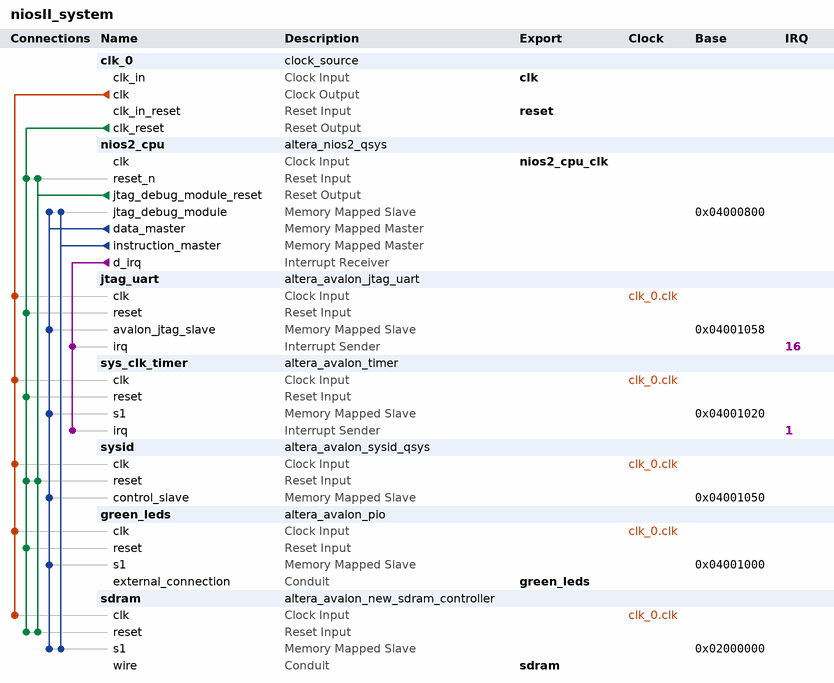
[diagram p0: system contents]
# Platform Designer (Qsys) system niosII_system, Cyclone IV E EP4CE22F17C6
# Parameters at their usual value, and those the tool derives, are not listed.
package require -exact qsys 12.1
create_system niosII_system
set_project_property DEVICE_FAMILY {Cyclone IV E}
set_project_property DEVICE EP4CE22F17C6

add_instance clk_0 clock_source 12.1
set_instance_parameter_value clk_0 clockFrequency 100000000
set_instance_parameter_value clk_0 resetSynchronousEdges DEASSERT

add_instance nios2_cpu altera_nios2_qsys 12.1
set_instance_parameter_value nios2_cpu resetSlave sdram.s1
set_instance_parameter_value nios2_cpu exceptionSlave sdram.s1
set_instance_parameter_value nios2_cpu breakSlave nios2_cpu.jtag_debug_module
set_instance_parameter_value nios2_cpu impl Fast
set_instance_parameter_value nios2_cpu icache_size 8192
set_instance_parameter_value nios2_cpu dcache_size 4096

add_instance jtag_uart altera_avalon_jtag_uart 12.1
set_instance_parameter_value jtag_uart simInteractiveOptions INTERACTIVE_INPUT_OUTPUT

add_instance sys_clk_timer altera_avalon_timer 12.1
set_instance_parameter_value sys_clk_timer period 1
set_instance_parameter_value sys_clk_timer periodUnits MSEC
set_instance_parameter_value sys_clk_timer timerPreset CUSTOM

add_instance sysid altera_avalon_sysid_qsys 12.1
set_instance_parameter_value sysid id 0

add_instance green_leds altera_avalon_pio 12.1
set_instance_parameter_value green_leds bitModifyingOutReg true
set_instance_parameter_value green_leds direction Output
set_instance_parameter_value green_leds width 7

add_instance sdram altera_avalon_new_sdram_controller 12.1
set_instance_parameter_value sdram TAC 5.5
set_instance_parameter_value sdram TRCD 20.0
set_instance_parameter_value sdram TRP 20.0
set_instance_parameter_value sdram casLatency 3
set_instance_parameter_value sdram columnWidth 9
set_instance_parameter_value sdram dataWidth 16
set_instance_parameter_value sdram generateSimulationModel false
set_instance_parameter_value sdram initRefreshCommands 8
set_instance_parameter_value sdram model custom
set_instance_parameter_value sdram numberOfBanks 4
set_instance_parameter_value sdram numberOfChipSelects 1
set_instance_parameter_value sdram powerUpDelay 200.0
set_instance_parameter_value sdram refreshPeriod 7.8125
set_instance_parameter_value sdram rowWidth 13

# connections
add_connection clk_0.clk green_leds.clk clock
add_connection clk_0.clk jtag_uart.clk clock
add_connection clk_0.clk sdram.clk clock
add_connection clk_0.clk sys_clk_timer.clk clock
add_connection clk_0.clk sysid.clk clock
add_connection clk_0.clk_reset green_leds.reset reset
add_connection clk_0.clk_reset jtag_uart.reset reset
add_connection clk_0.clk_reset nios2_cpu.reset_n reset
add_connection clk_0.clk_reset sdram.reset reset
add_connection clk_0.clk_reset sys_clk_timer.reset reset
add_connection clk_0.clk_reset sysid.reset reset
add_connection nios2_cpu.jtag_debug_module_reset nios2_cpu.reset_n reset
add_connection nios2_cpu.jtag_debug_module_reset sdram.reset reset
add_connection nios2_cpu.jtag_debug_module_reset sysid.reset reset
add_connection nios2_cpu.data_master green_leds.s1 avalon
set_connection_parameter_value nios2_cpu.data_master/green_leds.s1 baseAddress 0x04001000
add_connection nios2_cpu.data_master jtag_uart.avalon_jtag_slave avalon
set_connection_parameter_value nios2_cpu.data_master/jtag_uart.avalon_jtag_slave baseAddress 0x04001058
add_connection nios2_cpu.data_master nios2_cpu.jtag_debug_module avalon
set_connection_parameter_value nios2_cpu.data_master/nios2_cpu.jtag_debug_module baseAddress 0x04000800
add_connection nios2_cpu.data_master sdram.s1 avalon
set_connection_parameter_value nios2_cpu.data_master/sdram.s1 baseAddress 0x02000000
add_connection nios2_cpu.data_master sys_clk_timer.s1 avalon
set_connection_parameter_value nios2_cpu.data_master/sys_clk_timer.s1 baseAddress 0x04001020
add_connection nios2_cpu.data_master sysid.control_slave avalon
set_connection_parameter_value nios2_cpu.data_master/sysid.control_slave baseAddress 0x04001050
add_connection nios2_cpu.instruction_master nios2_cpu.jtag_debug_module avalon
set_connection_parameter_value nios2_cpu.instruction_master/nios2_cpu.jtag_debug_module baseAddress 0x04000800
add_connection nios2_cpu.instruction_master sdram.s1 avalon
set_connection_parameter_value nios2_cpu.instruction_master/sdram.s1 baseAddress 0x02000000
add_connection nios2_cpu.d_irq jtag_uart.irq interrupt
set_connection_parameter_value nios2_cpu.d_irq/jtag_uart.irq irqNumber 16
add_connection nios2_cpu.d_irq sys_clk_timer.irq interrupt
set_connection_parameter_value nios2_cpu.d_irq/sys_clk_timer.irq irqNumber 1

# exported interfaces
add_interface sdram conduit end
set_interface_property sdram EXPORT_OF sdram.wire
add_interface green_leds conduit end
set_interface_property green_leds EXPORT_OF green_leds.external_connection
add_interface clk clock sink
set_interface_property clk EXPORT_OF clk_0.clk_in
add_interface reset reset sink
set_interface_property reset EXPORT_OF clk_0.clk_in_reset
add_interface nios2_cpu_clk clock sink
set_interface_property nios2_cpu_clk EXPORT_OF nios2_cpu.clk

save_system niosII_system.qsys
